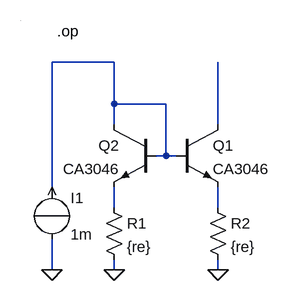
[diagram p0: schematic stromspiegel_1.asc]
stromspiegel_1.asc, the LTspice schematic file:
Version 4
SHEET 1 880 680
WIRE 144 64 48 64
WIRE 144 128 144 64
WIRE 224 128 144 128
WIRE 144 160 144 128
WIRE 304 160 304 64
WIRE 224 208 224 128
WIRE 224 208 208 208
WIRE 240 208 224 208
WIRE 48 256 48 64
WIRE 144 288 144 256
WIRE 304 288 304 256
WIRE 48 384 48 336
WIRE 144 384 144 368
WIRE 304 384 304 368
WIRE 0 0 0 0
FLAG 144 384 0
FLAG 304 384 0
FLAG 48 384 0
SYMBOL EIT_Semiconductors\\npn 240 160 R0
SYMATTR InstName Q1
SYMATTR Value CA3046
SYMBOL EIT_Semiconductors\\npn 208 160 M0
SYMATTR InstName Q2
SYMATTR Value CA3046
SYMBOL res 128 272 R0
SYMATTR InstName R1
SYMATTR Value {re}
SYMBOL res 288 272 R0
SYMATTR InstName R2
SYMATTR Value {re}
SYMBOL source-I 48 256 R0
SYMATTR InstName I1
SYMATTR Value 1m
TEXT 56 16 Left 2 !.op

The netlist it stands for:
* stromspiegel_1.asc
Q1 N002 N001 N004 0 CA3046
Q2 N001 N001 N003 0 CA3046
R1 N003 0 {re}
R2 N004 0 {re}
I1 0 N001 1m
.model NPN NPN
.model PNP PNP
.lib standard.bjt
.op
.backanno
.end